# Altium project PCB_Project_Soldeerstation.PrjPcb
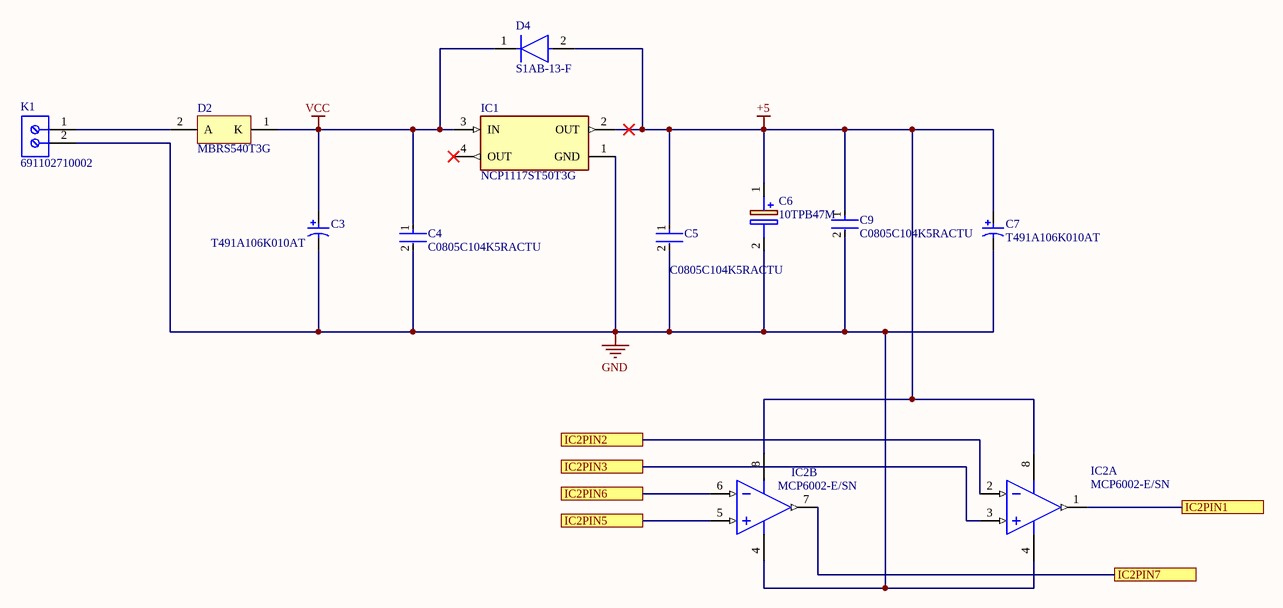
[diagram p0: Schema_Soldeerbout1.SchDoc]
6 sheets, 67 parts. Net scope: flat (ports and power ports of the same name join across sheets).
Board file: Soldeerstation_PCB.PcbDoc
Sheets:
  Schema_Soldeerbout1.SchDoc
  Schema_Soldeerbout2.SchDoc
  ATMEGA.SchDoc
  Schema_Soldeerbout3.SchDoc
  Schema_Soldeerbout4.SchDoc
  Schema_Soldeerbout5.SchDoc

## Sheet Schema_Soldeerbout1.SchDoc
size A4; SheetNumber: 1; SheetTotal: 6

### Parts
C3  T491A106K010AT  [KEMT-A-3216-18-2_M]
C4  C0805C104K5RACTU  [FP-C0805C-DN-MFG]
C5  C0805C104K5RACTU  [FP-C0805C-DN-MFG]
C6  10TPB47M  [CAPPM3528X210N]
C7  T491A106K010AT  [KEMT-A-3216-18-2_M]
C9  C0805C104K5RACTU  [FP-C0805C-DN-MFG]
D2  MBRS540T3G  [ONSC-SMC-2-403-03_V]
D4  S1AB-13-F  [FP-SMB-MFG]
IC1  NCP1117ST50T3G  [FP-318H-MFG]
IC2  MCP6002-E/SN  [SOIC-SN8_M]  (parts A,B of 2)
K1  691102710002  [691102710002]

### Ports
IC2PIN1, IC2PIN2, IC2PIN3, IC2PIN5, IC2PIN6, IC2PIN7

### Nets
+5: C5.1 C6.1(+) C7.1 C9.1 D4.2(A) IC1.2(OUT) IC2.8(VDD)
GND: C3.2 C4.2 C5.2 C6.2(-) C7.2 C9.2 IC1.1(GND) IC2.4(VSS) K1.2
VCC: C3.1 C4.1 D2.1(K) D4.1(C) IC1.3(IN)
NetC12_1: IC2.3(VINA+) ; port IC2PIN3
NetD2_2: D2.2(A) K1.1
NetIC2_1: IC2.1(VOUTA) ; port IC2PIN1
NetIC2_2: IC2.2(VINA-) ; port IC2PIN2
NetIC2_5: IC2.5(VINB+) ; port IC2PIN5
NetIC2_6: IC2.6(VINB-) IC2.7(VOUTB) ; port IC2PIN7, port IC2PIN6

Not connected (* = marked no-connect by the designer): IC1 4(OUT)*

### Library data of the parts
C3 C7 = CMP-2000-05172-1: Capacitor, Tantalum, 10 uF, +/- 10%, 10 V, -55 to 125 degC, 2-Pin SMD (1206), RoHS, Tape and Reel; Manufacturer Size Code: A; Manufacturer: Kemet; Type: Molded; Online Catalog: T491Series; Other Names: 399-3684-2; Voltage - Rated: 10V; Lifetime @ Temp.: 2000Hrs@85degC; Product Training Modules: CapacitorBasics-TypicalUsesforCapacitorsDeratingGuidelinesforSurfaceMountTantalumCapacitors; ESR (Equivalent Series Resistance): 3.8Ohm; Capacitance: 10µF; Catalog Drawings: T49x,T5xxSeries_A-side1T49x,T5xxSeries_A,B-side2T49x,T5xxSeries_A,SBottom; Family: TantalumCapacitors; Manufacturer URL: http://www.kemet.com/; Datasheet URL: http://www.farnell.com/datasheets/1824869.pdf; Package Reference: 1206; Packaging: Tape&Reel(TR); Series: T491; Operating Temperature: -55degC~125degC; Mounting Type: SurfaceMount; Height - Seated (Max): 0.071"(1.80mm); Package / Case: 1206(3216Metric); Package Description: 2-Pin Surface Mount Device, Body 3.2 x 1.6 mm; Features: GeneralPurpose; Tolerance: ±10%; Lead Spacing: -; Size / Dimension: 0.126"Lx0.063"W(3.20mmx1.60mm); Standard Package: 2,000; Datasheet Version: Apr-14; Category: Capacitors
C4 C5 C9 = CMP-2007-00279-2: CAP CER 0.1UF 50V X7R 0805; Manufacturer: KEMET; Value: 0.10 μF; Tolerance: 0.1; Temperature Coefficient: 30ppm/°C; Material: Ceramic; Manufacturer Part Number: C0805C104K5RACTU; Device Class L2: Capacitors; Temperature Range Low: -55°C; Voltage Rating: 50 V; Digikey Description: CAP CER 0.1UF 50V X7R 0805; Category: Cap; ComponentLink2Description: Datasheet; Octopart: https://octopart.com/c0805c104k5ractu-kemet-143926; RoHS: TRUE; ComponentLink2URL: https://content.kemet.com/datasheets/KEM_C1003_C0G_SMD.pdf; Temperature Characteristic: X7R; Temperature: -55°C to +125°C; Height: 0.88mm; Temperature Range High: +125°C; Device Class L1: Passive Components; Automotive: No; Lead Free: Yes; Ipc Land Pattern Name: CAPC200125X78; Device Class L3: Ceramic Capacitors; Mouser Description: Cap Ceramic 0.1uF 50V X7R 10% SMD 2.0 x 1.2 mm 125 C Paper T/R; Capacitance: 0.10 μF; Package: C0805C-DN
C6 = 10TPB47M: Capacitor Polarised; Manufacturer_Name: Panasonic; Datasheet Link: https://www.mouser.com/datasheet/2/315/AAA8000C65-1150039.pdf; Height: 2.1mm; Manufacturer_Part_Number: 10TPB47M; Mouser Part Number: 667-10TPB47M; Mouser Price/Stock: https://www.mouser.co.uk/ProductDetail/Panasonic/10TPB47M/?qs=OE1iw1LrrPF6e38T0%252BNoyw%3D%3D; Arrow Part Number: 10TPB47M; Arrow Price/Stock: https://www.arrow.com/en/products/10tpb47m/panasonic
D2 = CMP-1055-00390-1: Schottky Power Rectifier, 2-Pin SMC, Pb-Free, Tape and Reel; Manufacturer: On Semiconductor; Configuration: Single; IFSM Max (A): 190; ComponentLink1URL: http://www.onsemi.com/; ComponentLink3URL: http://www.onsemi.com/pub_link/Collateral/403-03.PDF; ComponentLink1Description: Manufacturer URL; PackageVersion: Rev. E, 08/2005; Packing: Tape and Reel; ComponentLink2URL: http://www.onsemi.cn/pub_link/Collateral/MBRS540T3-D.PDF; RoHS: TRUE; DatasheetVersion: Rev. 8; Mounting Technology: Surface Mount; ComponentLink3Description: Package Specification; ComponentLink2Description: Datasheet; PartNumber: MBRS540T3G; PackageDescription: 2-Pin Small Molded Package, J-Bend Lead, Body 5.845 x 6.855 mm; PackageReference: SMC-2-403-03
D4 = CMP-0586-00001-3: DIODE GEN PURP 50V 1A SMB; Element Configuration: Single; Max Surge Current: 30A; Polarity: Standard; Recovery Time: 1.8us; Forward Voltage: 1.1V; Capacitance: 10pF; Peak Reverse Current: 5uA; Voltage Rating (DC): 50V; Weight: 0.00328oz; Average Rectified Current: 1A; Output Current: 1A; Number of Pins: 2; Lead Free: Lead Free; Packaging: Tape and Reel; Height: 2.42mm; Current Rating: 1A; Forward Current: 1A; Peak Non-Repetitive Surge Current: 30A; Reverse Voltage (DC): 50V; Max Reverse Voltage (DC): 50V; Reverse Recovery Time: 1.8us; Width: 3.94mm; Radiation Hardening: No; Case/Package: SMB; Min Operating Temperature: -65°C; Termination: SMD/SMT; Max Operating Temperature: 150°C; Package Quantity: 3000; Length: 4.57mm; Max Repetitive Reverse Voltage (Vrrm): 50V
IC1 = CMP-0592-00001-3: IC REG LINEAR 5V 1A SOT223; Output Type: Fixed; Quiescent Current: 10mA; Number of Outputs: 1; Polarity: Positive; Min Input Voltage: 3.5V; Input Bias Current: 6mA; Dropout Voltage: 1.2V; Power Rating: 781mW; Accuracy: 1%; Max Input Voltage: 20V; Max Output Current: 1A; Output Current: 1A; Packaging: Tape and Reel; Contact Plating: Tin; Package Quantity: 1; Halogen Free: Halogen Free; Case/Package: SOT-223; Radiation Hardening: No; Min Operating Temperature: 0°C; Min Current Limit: 1A; Max Operating Temperature: 125°C; Number of Regulators: 1; Number of Pins: 4; Width: 3.7mm; Lead Free: Lead Free; Output Voltage Accuracy: 1%; REACH SVHC: No SVHC; Length: 6.7mm; Output Voltage: 5V; Tolerance: 1%; Height: 1.69mm; Nominal Output Voltage: 5V
IC2 = CMP-0187-00368-2: 1 MHz, Low-Power Operational Amplifier, 8-Pin SOIC, Extended Temperature; ComponentLink1URL: http://www.microchip.com/; ComponentLink2URL: http://ww1.microchip.com/downloads/en/DeviceDoc/21733j.pdf; ComponentLink3URL: http://www.microchip.com/stellent/groups/techpub_sg/documents/packagingspec/en012702.pdf; Code_JEDEC: MS-012; PackageVersion: revBB, Aug-2009; ComponentLink2Description: Datasheet; PackageDescription: 8-Lead Plastic Small Outline (SN) - Narrow, 3.90mm Body [SOIC]; PackageReference: SOIC-SN8; ComponentLink1Description: Manufacturer URL; RevisionNote: URLs added.; Code_IPC: SOIC127P600-8; ComponentLink3Description: Package Specification; DatasheetVersion: revJ, Nov-2009
K1 = CMP-1502-03258-1: Series 102 - 5.00 mm Horizontal Entry Modular with Pressure Clamp WR-TBL, 2 pin; Manufacturer: Wurth Elektronik; Pin Number: 2; Pitch: 5.00mm; Manufacturer URL: http://www.we-online.de; Mounting Technology: THT; Publisher: WurthElektronik; Packaging: Box; Package Reference: 691102710002; Datasheet URL: http://katalog.we-online.de/em/datasheet/6911027100xx.pdf; Operating Temperature: -40to105degC; Part Number: 691102710002

## Sheet Schema_Soldeerbout2.SchDoc
size A4; SheetNumber: 2; SheetTotal: 6
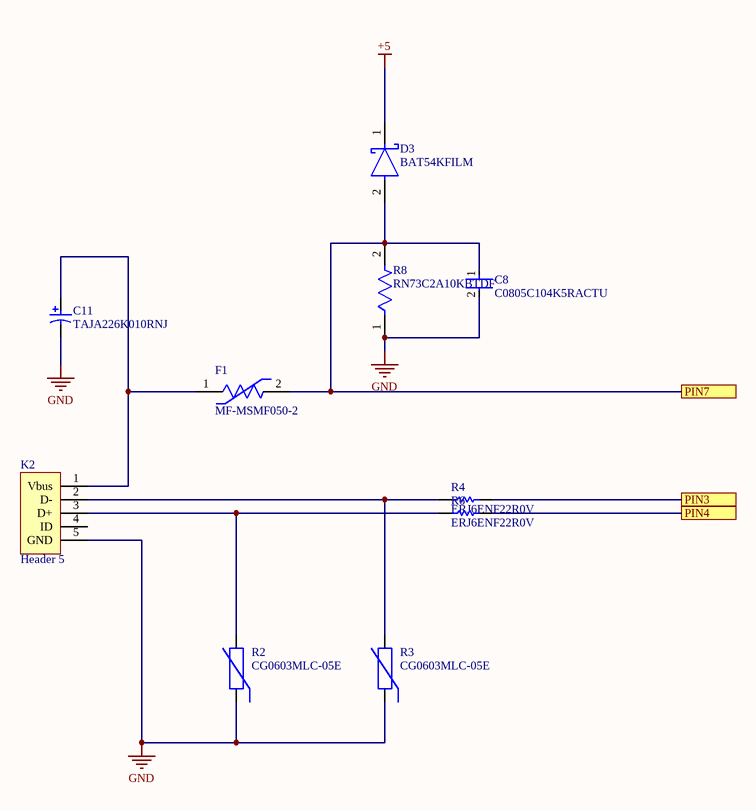
[diagram p1: Schema_Soldeerbout2.SchDoc]

### Parts
C8  C0805C104K5RACTU  [FP-C0805C-DN-MFG]
C11  TAJA226K010RNJ  [AVX-TAJ-A-2_L]
D3  BAT54KFILM  [FP-SOD-523-MFG]
F1  MF-MSMF050-2  [FP-MF-MSMF050-2-MFG]
K2  Header 5  [HDR1X5]
R2  CG0603MLC-05E  [BOUR-CG0603-2_V]
R3  CG0603MLC-05E  [BOUR-CG0603-2_V]
R4  ERJ6ENF22R0V  [RESC2013X70X40LL20T20]
R6  ERJ6ENF22R0V  [RESC2013X70X40LL20T20]
R8  RN73C2A10KBTDF  [FP-RN732A-MFG]

### Ports
PIN3, PIN4, PIN7

### Nets
+5: D3.1(C)
GND: C8.2 C11.2 K2.5(GND) R2.1 R3.1 R8.1
NetC8_1: C8.1 D3.2(A) F1.2 R8.2 ; port PIN7
NetC11_1: C11.1 F1.1 K2.1(Vbus)
NetIC4_3: R4.2 ; port PIN3
NetIC4_4: R6.2 ; port PIN4
NetK2_2: K2.2(D-) R3.2 R4.1
NetK2_3: K2.3(D+) R2.2 R6.1

Not connected (* = marked no-connect by the designer): K2 4(ID)

### Library data of the parts
C8 = CMP-2007-00279-2: as C4 on sheet Schema_Soldeerbout1; Manufacturer Part Number: C0805C104K5RACTU; Device Class L2: Capacitors; Temperature Range Low: -55°C; Voltage Rating: 50 V; Digikey Description: CAP CER 0.1UF 50V X7R 0805; Category: Cap; ComponentLink2Description: Datasheet; Octopart: https://octopart.com/c0805c104k5ractu-kemet-143926; RoHS: TRUE; ComponentLink2URL: https://content.kemet.com/datasheets/KEM_C1003_C0G_SMD.pdf; Temperature Characteristic: X7R; Temperature: -55°C to +125°C; Height: 0.88mm; Temperature Range High: +125°C; Device Class L1: Passive Components; Automotive: No; Lead Free: Yes; Ipc Land Pattern Name: CAPC200125X78; Device Class L3: Ceramic Capacitors; Mouser Description: Cap Ceramic 0.1uF 50V X7R 10% SMD 2.0 x 1.2 mm 125 C Paper T/R; Capacitance: 0.10 μF; Package: C0805C-DN
C11 = CMP-2000-07524-1: Chip Capacitor, 22 uF, +/- 10%, 10 V, -55 to 125 degC, 1206 (3216 Metric), RoHS, Tape and Reel; Manufacturer: AVX; Leakage Current: 2.2uA; Polarity: Polar; Dielectric Material: Tantalum; Voltage Rating (DC): 10V; Dissipation Factor: 8%; ESR (Equivalent Series Resistance): 3Ohm; Capacitance: 22uF; Height - Seated (Max): 0.071inch; Number of Pins: 2; Termination: SMD/SMT; Package Quantity: 1; Datasheet Version: 09/2017; Packaging: TapeandReel; Case/Package: 1206; Lead Free: LeadFree; Manufacturer URL: http://www.avx.com/; RoHSCompliant: True; Mount: PCB; Package Reference: TAJ-A-2; Width: 1.6mm; Height: 1.6mm; Radiation Hardening: No; Lead Pitch: 1.1mm; Tolerance: 10%; REACH SVHC: NoSVHC; Depth: 1.6mm; Package Description: 2-Pin Surface Mount Device, Body 3.2 x 1.65 mm; Case Code (Metric): 3216; Case Code (Imperial): 1206; Mounting Technology: SurfaceMount; Datasheet URL: http://datasheets.avx.com/TAJ.pdf; Voltage: 10V; Length: 3.2mm; Max Operating Temperature: 125degC; Voltage Rating: 10V; Min Operating Temperature: -55degC
D3 = CMP-12187-000026-1: DIODE SCHOTTKY 40V 300MA SOD523; Manufacturer: STMicroelectronics; Capacitance: 7pF; Value: 7pF; Max Surge Forward Current: 1.25A; Peak Reverse Current: 1uA; Max Junction Temp: +150°C; Device Class L2: Diodes; Temperature Range Low: -40°C; Category: Diode; Manufacturer Part Number: BAT54KFILM; Digikey Description: DIODE SCHOTTKY 40V 300MA SOD523; Device Class L3: Schottky Diodes; Automotive: No; Height: 0.7mm; Octopart: https://octopart.com/bat54kfilm-stmicroelectronics-39618022; ComponentLink2Description: Datasheet; Temperature Range High: +150°C; Device Class L1: Discrete Semiconductors; Max Repetitive Reverse Voltage: 40V; RoHS: TRUE; Temperature: -40°C to +150°C; ComponentLink2URL: https://www.st.com/content/ccc/resource/technical/document/datasheet/07/50/54/f2/0d/ba/4a/79/CD00001322.pdf/files/CD00001322.pdf/jcr:content/translations/en.CD00001322.pdf; Lead Free: Yes; Forward Current: 300mA; Package: SOD-523; Mouser Description: Schottky Diodes & Rectifiers schottky diode
F1 = CMP-2100-03653-2: PTC RESET FUSE 15V 500MA 1812; Manufacturer: Bourns; Value: 0.15-1Ω; Trip Current: 1A; Automotive Grade: Grade 3; Trip Time: 0.15s; Current Rating: 100A; Hold Current: 0.5A; Height: 0.85mm; Package: 1812; Voltage Rating: 15V; Temperature Range High: +85°C; Device Class L2: PTC Resettable Fuses; Lead Free: Yes; ComponentLink2URL: http://www.bourns.com/docs/Product-Datasheets/mfmsmf.pdf; Ambient Temperature Range High: +85°C; Mouser Description: PTC Resettable Fuse 0.5A(hold) 1A(trip) 15V 100A 0.8W 0.15s 0.15Ohm SMD Solder Pad 1812 T/R; Digikey Description: PTC RESET FUSE 15V 500MA 1812; Manufacturer Part Number: MF-MSMF050-2; Resistance: 0.15-1Ω; Category: Fuse; ComponentLink2Description: Datasheet; Automotive: Yes; Temperature Range Low: -40°C; RoHS: TRUE; Device Class L1: Circuit Protection; Temperature: -40°C to +85°C; Octopart: https://octopart.com/mf-msmf050-2-bourns-28047; Ambient Temperature Range Low: -40°C; Device Class L3: unset
K2 = Header 5: Header, 5-Pin; LatestRevisionDate: 17-Jul-2002; LatestRevisionNote: Re-released for DXP Platform.; Publisher: Altium Limited
R2 R3 = CMP-0584-00001-2: ESD Protector, 5 V Supply, -40 to 85 degC, 1.6 x 0.8 x 0.55 mm SMD, RoHS, Tape and Reel; Manufacturer: Bourns; VC: 20 V; VT: 150 V; RT: 1 ns; VDC: 5 V; CO: 0.5 pF; PartNumber: CG0603MLC-05E; ComponentLink1Description: Manufacturer URL; ComponentLink1URL: http://www.bourns.com/; Packing: Tape and Reel; Mounting Technology: Surface Mount; ComponentLink2Description: Datasheet; RoHS: TRUE; Operating Temperature: -40 to 85 degC; DatasheetVersion: Rev. S; PackageDescription: 2-Pin SMD, Body 1.6 x 0.8 mm, Pitch 1.52 mm; PackageReference: CG0603-2; ComponentLink2URL: http://www.bourns.com/data/global/pdfs/MLC.pdf
R4 R6 = CMP-2001-00523-1: Manufacturer: Panasonic; Part Number: ERJ6ENF22R0V
R8 = CMP-03211-000130-1: SMD Chip Resistor, Thin Film, 10KΩ, 100 V, 0805 [2012 Metric], 100 mW, 0.1%, RN73 Series; Manufacturer: TE Connectivity; Power Rating: 0.1W; Temperature Coefficient: 10ppm/°C; Voltage Rating: 100V; Package: RN732A; Ipc Land Pattern Name: RESC200125X55; RoHS: TRUE; packaging: 1000 Reel; Resistance: 10KΩ; Octopart: https://octopart.com/rn73c2a10kbtdf-te+connectivity-21400356; Temperature Range Low: -55°C; Device Class L1: Passive Components; Tolerance: 0.1%; ComponentLink2URL: https://www.te.com/commerce/DocumentDelivery/DDEController?Action=showdoc&DocId=Data+Sheet%7F1773270%7FP%7Fpdf%7FEnglish%7FENG_DS_1773270_P.pdf%7F1676162-2; Height: 0.65mm; Composition: Thin Film; Temperature Range High: 155°C; Automotive: No; Series: RN73; Lead Free: Yes; Value: 10KΩ; Category: Res; Device Class L2: Resistors; Temperature: -55°C to 155°C; octopart_url: https://octopart.com/rn73c2a10kbtdf-te+connectivity-21400356; Device Class L3: Chip SMD Resistors; ComponentLink2Description: Datasheet; Manufacturer Part Number: RN73C2A10KBTDF

## Sheet ATMEGA.SchDoc
size A4; SheetNumber: 3; SheetTotal: 6
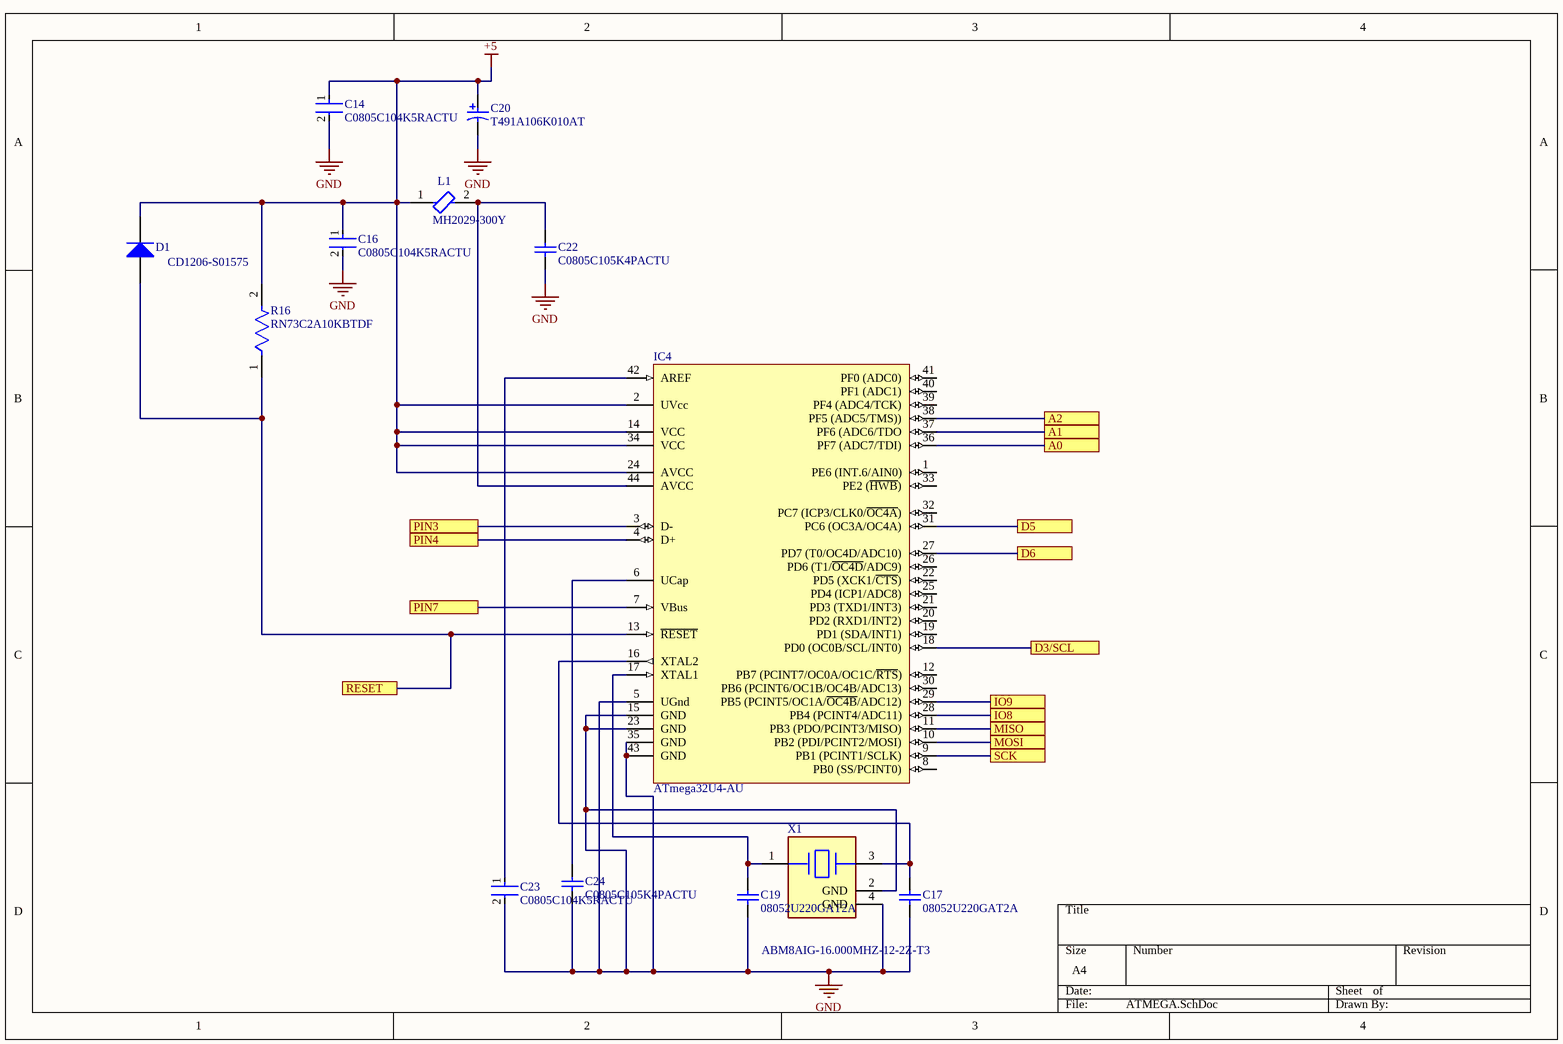
[diagram p2: ATMEGA.SchDoc]

### Parts
C14  C0805C104K5RACTU  [FP-C0805C-DN-MFG]
C16  C0805C104K5RACTU  [FP-C0805C-DN-MFG]
C17  08052U220GAT2A  [CAPC2013X115X51NL20T26]
C19  08052U220GAT2A  [CAPC2013X115X51NL20T26]
C20  T491A106K010AT  [KEMT-A-3216-18-2_M]
C22  C0805C105K4PACTU  [CAPC2013X145X50LL20T25]
C23  C0805C104K5RACTU  [FP-C0805C-DN-MFG]
C24  C0805C105K4PACTU  [CAPC2013X145X50LL20T25]
D1  CD1206-S01575  [BOUR-CD1206-S01575-2_L]
IC4  ATmega32U4-AU  [44ML_M]
L1  MH2029-300Y  [FP-MH2029-MFG]
R16  RN73C2A10KBTDF  [FP-RN732A-MFG]
X1  ABM8AIG-16.000MHZ-12-2Z-T3  [FP-ABM8AIG-MFG]

### Ports
A0, A1, A2, D3/SCL, D5, D6, IO8, IO9, MISO, MOSI, PIN3, PIN4, PIN7, RESET, SCK

### Nets
+5: C14.1 C16.1 C20.1 D1.2(K) IC4.2(UVcc) IC4.14(VCC) IC4.24(AVCC) IC4.34(VCC) L1.1 R16.2
GND: C14.2 C16.2 C17.1 C19.1 C20.2 C22.1 C23.2 C24.1 IC4.5(UGnd) IC4.15(GND) IC4.23(GND) IC4.35(GND) IC4.43(GND) X1.2(GND) X1.4(GND)
NetC1_2: IC4.27(PD7_(T0/OC4D/ADC10)) ; port D6
NetC2_2: IC4.29(PB5_(PCINT5/OC1A/~{OC4B}/ADC12)) ; port IO9
NetC8_1: IC4.7(VBus) ; port PIN7
NetC13_1: IC4.36(PF7_(ADC7/TDI)) ; port A0
NetC15_2: IC4.37(PF6_(ADC6/TDO) ; port A1
NetC17_2: C17.2 IC4.16(XTAL2) X1.3(2_Crystal)
NetC19_2: C19.2 IC4.17(XTAL1) X1.1(1_Crystal)
NetC22_2: C22.2 IC4.44(AVCC) L1.2
NetC23_1: C23.1 IC4.42(AREF)
NetC24_2: C24.2 IC4.6(UCap)
NetD1_1: D1.1(A) IC4.13(~{RESET}) R16.1 ; port RESET
NetENC1_1: IC4.28(PB4_(PCINT4/ADC11)) ; port IO8
NetIC4_3: IC4.3(D-) ; port PIN3
NetIC4_4: IC4.4(D+) ; port PIN4
NetIC4_9: IC4.9(PB1_(PCINT1/SCLK)) ; port SCK
NetIC4_10: IC4.10(PB2_(PDI/PCINT2/MOSI)) ; port MOSI
NetIC4_11: IC4.11(PB3_(PDO/PCINT3/MISO)) ; port MISO
NetIC4_18: IC4.18(PD0_(OC0B/SCL/INT0)) ; port D3/SCL
NetIC4_31: IC4.31(PC6_(OC3A/OC4A)) ; port D5
NetIC4_38: IC4.38(PF5_(ADC5/TMS))) ; port A2

Not connected (* = marked no-connect by the designer): IC4 1(PE6_(INT.6/AIN0)) 8(PB0_(SS/PCINT0)) 12(PB7_(PCINT7/OC0A/OC1C/~{RTS})) 19(PD1_(SDA/INT1)) 20(PD2_(RXD1/INT2)) 21(PD3_(TXD1/INT3)) 22(PD5_(XCK1/~{CTS})) 25(PD4_(ICP1/ADC8)) 26(PD6_(T1/~{OC4D}/ADC9)) 30(PB6_(PCINT6/OC1B/OC4B/ADC13)) 32(PC7_(ICP3/CLK0/~{OC4A})) 33(PE2_(~{HWB})) 39(PF4_(ADC4/TCK)) 40(PF1_(ADC1)) 41(PF0_(ADC0))

### Library data of the parts
C14 C16 C23 = CMP-2007-00279-2: as C4 on sheet Schema_Soldeerbout1; Manufacturer Part Number: C0805C104K5RACTU; Device Class L2: Capacitors; Temperature Range Low: -55°C; Voltage Rating: 50 V; Digikey Description: CAP CER 0.1UF 50V X7R 0805; Category: Cap; ComponentLink2Description: Datasheet; Octopart: https://octopart.com/c0805c104k5ractu-kemet-143926; RoHS: TRUE; ComponentLink2URL: https://content.kemet.com/datasheets/KEM_C1003_C0G_SMD.pdf; Temperature Characteristic: X7R; Temperature: -55°C to +125°C; Height: 0.88mm; Temperature Range High: +125°C; Device Class L1: Passive Components; Automotive: No; Lead Free: Yes; Ipc Land Pattern Name: CAPC200125X78; Device Class L3: Ceramic Capacitors; Mouser Description: Cap Ceramic 0.1uF 50V X7R 10% SMD 2.0 x 1.2 mm 125 C Paper T/R; Capacitance: 0.10 μF; Package: C0805C-DN
C17 C19 = CMP-2007-04866-1: Manufacturer: AVX Interconnect / Elco; Part Number: 08052U220GAT2A
C20 = CMP-2000-05172-1: as C3 on sheet Schema_Soldeerbout1; Family: TantalumCapacitors; Manufacturer URL: http://www.kemet.com/; Datasheet URL: http://www.farnell.com/datasheets/1824869.pdf; Package Reference: 1206; Packaging: Tape&Reel(TR); Series: T491; Operating Temperature: -55degC~125degC; Mounting Type: SurfaceMount; Height - Seated (Max): 0.071"(1.80mm); Package / Case: 1206(3216Metric); Package Description: 2-Pin Surface Mount Device, Body 3.2 x 1.6 mm; Features: GeneralPurpose; Tolerance: ±10%; Lead Spacing: -; Size / Dimension: 0.126"Lx0.063"W(3.20mmx1.60mm); Standard Package: 2,000; Datasheet Version: Apr-14; Category: Capacitors
C22 C24 = CMP-1036-04746-2: Manufacturer: Kemet; Part Number: C0805C105K4PACTU
D1 = CMP-0583-00001-2: 75 V Small Signal Switching Diode, 150 mA, 2.5 uA, 1026 Molded Package, RoHS, Tape and Reel; Manufacturer: Bourns; Reverse Voltage: 75 V; Average Forward Current: 150 mA; Reverse Current (Max.): 2.5 uA; Capacitance Between Terminals (Max.): 3 pF; Reverse Recovery Time (Max.): 4 nS; Forward Voltage (Max.): 1.00 V; Packing: Tape and Reel; Mounting Technology: Surface Mount; DatasheetVersion: Rev. 06/11; ComponentLink2URL: http://www.bourns.com/data/global/pdfs/CD1206_S01575.pdf; PackageReference: CD1206-S01575-2; RoHS: TRUE; ComponentLink1URL: http://www.bourns.com/; ComponentLink1Description: Manufacturer URL; ComponentLink3Description: Package Specification; ComponentLink3URL: http://www.bourns.com/data/global/pdfs/CD1206_S01575.pdf; ComponentLink2Description: Datasheet; PackageDescription: 2-Pin SMD, Body 3.2 x 1.5 mm; PartNumber: CD1206-S01575
IC4 = CMP-0095-00285-2: 8-bit AVR Microcontroller, 2.7-5.5V, 16MHz, 32KB Flash, 1KB EEPROM, 2.5KB SRAM, USB Controller, 44-pin TQFP, Industrial Grade (-40°C to 85°C), Ext Osc; RevisionNote: DatasheetVersion updated. URLs added.; ComponentLink1Description: Manufacturer URL; PackageDescription: 44-Pin Plastic Thin Quad Flat Pack, 10 x 10 x 1.0 mm Body, 0.8 mm Pitch (TQFP); DatasheetVersion: revF, Nov-2010; ComponentLink2URL: http://www.atmel.com/dyn/resources/prod_documents/doc7766.pdf; ComponentLink1URL: http://www.atmel.com/; PackageReference: 44ML; ComponentLink2Description: ATmega16U4/32U4 Datasheet; PackageVersion: rev.G, Jul-2007; ComponentLink3URL: http://www.atmel.com/dyn/resources/prod_documents/7766S.pdf; ComponentLink3Description: ATmega16U4 ATmega32U4 Summary
L1 = CMP-07252-000001-1: FERRITE BEAD 30 OHM 0805 1LN; Manufacturer: Bourns; Series Resistance: 25mΩ; Resistance: 30Ω; Value: 30Ω; Impedance At Frequency: 30Ω @ 100MHz; Rms Current: 3A; Tolerance: 25%; RoHS: TRUE; Manufacturer Part Number: MH2029-300Y; Temperature Range High: +125°C; Device Class L3: Ferrite Beads and Chips; Core Material: Ferrite; ComponentLink2Description: Datasheet; Category: FBead; Octopart: https://octopart.com/mh2029-300y-bourns-756929; Digikey Description: FERRITE BEAD 30 OHM 0805 1LN; Device Class L2: EMI / RFI Components; Lead Free: Yes; Mouser Description: Ferrite Beads 30 ohms 25% HIGH CURRENT; Automotive: No; Ipc Land Pattern Name: CAPC200120X90; Temperature: -55°C to +125°C; Device Class L1: Passive Components; Height: 1.1mm; ComponentLink2URL: https://www.bourns.com/docs/Product-Datasheets/mh.pdf; Package: MH2029; Temperature Range Low: -55°C
R16 = CMP-03211-000130-1: as R8 on sheet Schema_Soldeerbout2; Package: RN732A; Ipc Land Pattern Name: RESC200125X55; RoHS: TRUE; packaging: 1000 Reel; Resistance: 10KΩ; Octopart: https://octopart.com/rn73c2a10kbtdf-te+connectivity-21400356; Temperature Range Low: -55°C; Device Class L1: Passive Components; Tolerance: 0.1%; ComponentLink2URL: https://www.te.com/commerce/DocumentDelivery/DDEController?Action=showdoc&DocId=Data+Sheet%7F1773270%7FP%7Fpdf%7FEnglish%7FENG_DS_1773270_P.pdf%7F1676162-2; Height: 0.65mm; Composition: Thin Film; Temperature Range High: 155°C; Automotive: No; Series: RN73; Lead Free: Yes; Value: 10KΩ; Category: Res; Device Class L2: Resistors; Temperature: -55°C to 155°C; octopart_url: https://octopart.com/rn73c2a10kbtdf-te+connectivity-21400356; Device Class L3: Chip SMD Resistors; ComponentLink2Description: Datasheet; Manufacturer Part Number: RN73C2A10KBTDF
X1 = CMP-27762-000014-1: CRYSTAL 16MHZ 12PF SMD; Manufacturer: Abracon LLC; Automotive Grade: Grade 1; Stability: 50ppm; Tolerance: 20ppm; Esr: 70Ω; Load Capacitance: 12pF; Category: Crys; ComponentLink2Description: Datasheet; RoHS: TRUE; Temperature Range High: +125°C; Lead Free: Yes; Digikey Description: CRYSTAL 16MHZ 12PF SMD; Octopart: https://octopart.com/abm8aig-16.000mhz-12-2z-t3-abracon-70466545; Series: ABM8AIG; Manufacturer Part Number: ABM8AIG-16.000MHZ-12-2Z-T3; Automotive: Yes; Device Class L1: Passive Components; Mouser Description: Crystals 16MHz AECQ200 12pF 20ppm -40C +125C; Device Class L2: Crystals / Oscillators; ComponentLink2URL: https://abracon.com/AIGcrystals/ABM8AIG.pdf; Frequency: 16MHz; Package: ABM8AIG; Height: 0.8mm; Device Class L3: Crystals; Temperature Range Low: -40°C; Temperature: -40°C to +125°C

## Sheet Schema_Soldeerbout3.SchDoc
size A4; SheetNumber: 4; SheetTotal: 6
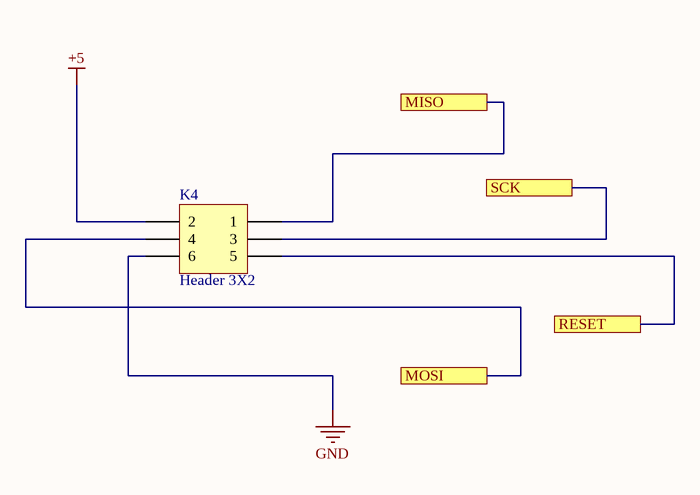
[diagram p3: Schema_Soldeerbout3.SchDoc]

### Parts
K4  Header 3X2  [HDR2X3]

### Ports
MISO, MOSI, RESET, SCK

### Nets
+5: K4.2
GND: K4.6
NetD1_1: K4.5 ; port RESET
NetIC4_9: K4.3 ; port SCK
NetIC4_10: K4.4 ; port MOSI
NetIC4_11: K4.1 ; port MISO

### Library data of the parts
K4 = Header 3X2: Header, 3-Pin, Dual row; LatestRevisionDate: 17-Jul-2002; LatestRevisionNote: Re-released for DXP Platform.; Publisher: Altium Limited

## Sheet Schema_Soldeerbout4.SchDoc
size A4; SheetNumber: 5; SheetTotal: 6
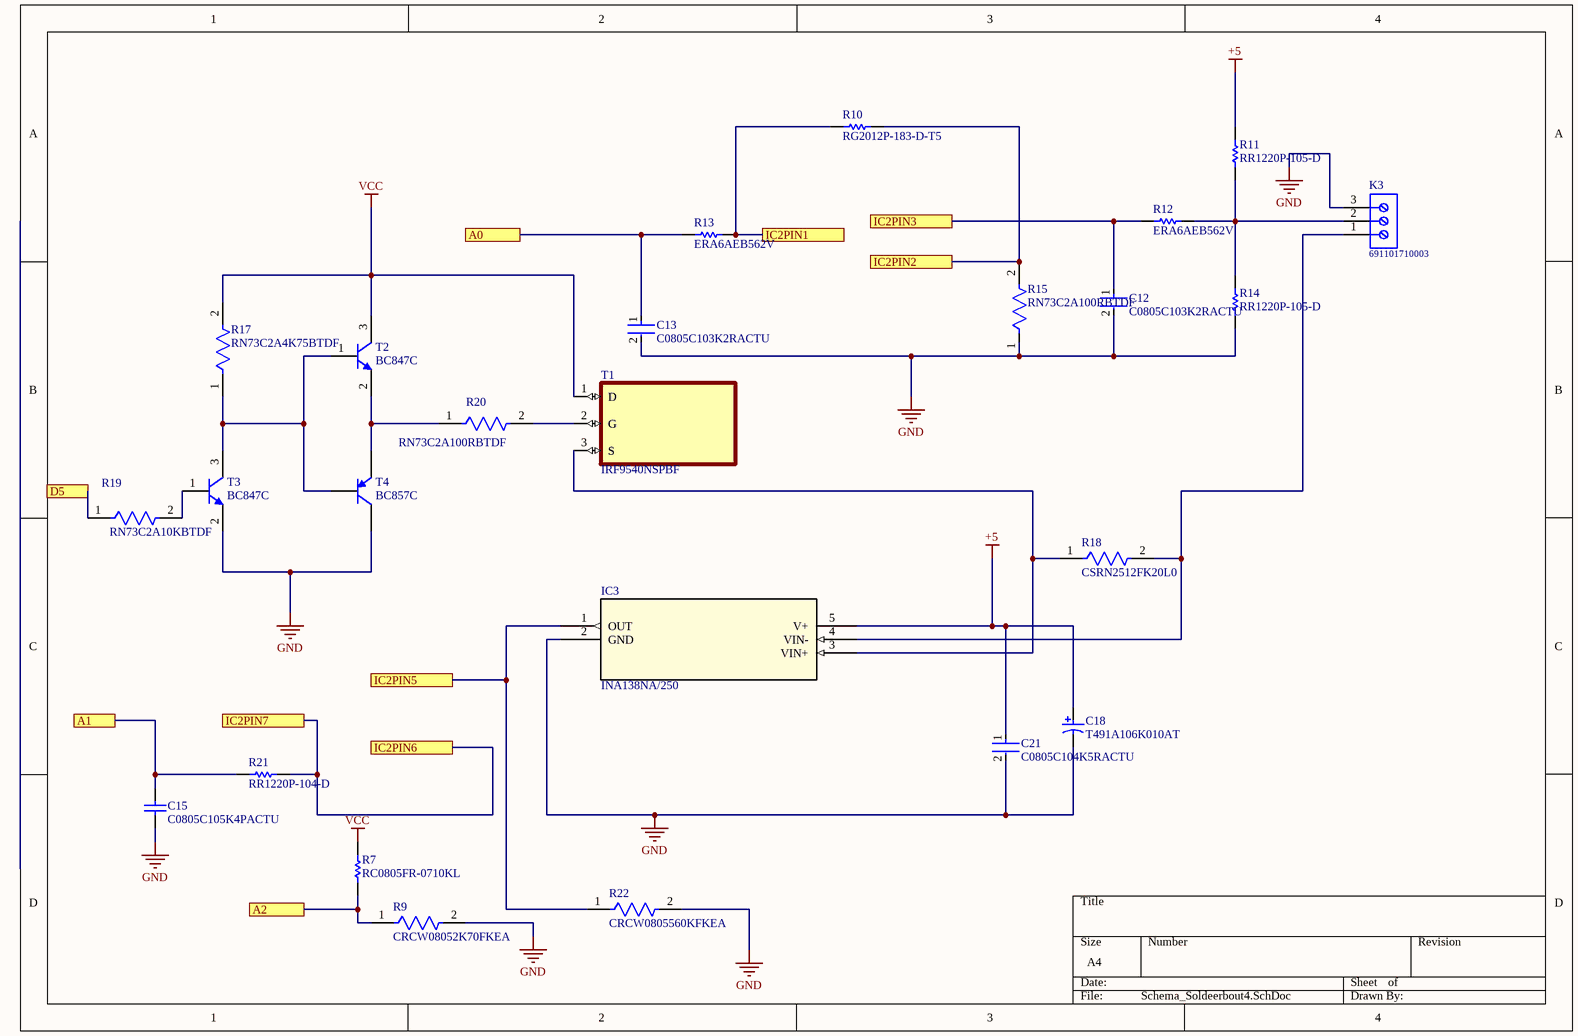
[diagram p4: Schema_Soldeerbout4.SchDoc]

### Parts
C12  C0805C103K2RACTU  [FP-C0805C-DN-MFG]
C13  C0805C103K2RACTU  [FP-C0805C-DN-MFG]
C15  C0805C105K4PACTU  [CAPC2013X145X50LL20T25]
C18  T491A106K010AT  [KEMT-A-3216-18-2_M]
C21  C0805C104K5RACTU  [FP-C0805C-DN-MFG]
IC3  INA138NA/250  [DBV5]
K3  691101710003  [691101710003]
R7  RC0805FR-0710KL  [RESC2013X60X35NL10T20]
R9  CRCW08052K70FKEA  [FP-CRCW0805-e3-IPC_C]
R10  RG2012P-183-D-T5  [RESC2013X50X40LL20T20]
R11  RR1220P-105-D  [RESC2013X50X40ML20T20]
R12  ERA6AEB562V  [RESC2013X60X40ML20T25]
R13  ERA6AEB562V  [RESC2013X60X40ML20T25]
R14  RR1220P-105-D  [RESC2013X50X40ML20T20]
R15  RN73C2A100RBTDF  [FP-RN732A-MFG]
R17  RN73C2A4K75BTDF  [FP-RN732A-MFG]
R18  CSRN2512FK20L0  [FP-CSRN2512-IPC_C]
R19  RN73C2A10KBTDF  [FP-RN732A-MFG]
R20  RN73C2A100RBTDF  [FP-RN732A-MFG]
R21  RR1220P-104-D  [RESC2013X50X40LL20T20]
R22  CRCW0805560KFKEA  [FP-CRCW0805-e3-IPC_A]
T1  IRF9540NSPBF  [DPAK508P1524X483-3N]
T2  BC847C  [INF-SOT23_L]
T3  BC847C  [INF-SOT23_L]
T4  BC857C  [INF-SOT23_N]

### Ports
A0, A1, A2, D5, IC2PIN1, IC2PIN2, IC2PIN3, IC2PIN5, IC2PIN6, IC2PIN7

### Nets
+5: C18.1 C21.1 IC3.5(V+) R11.2
GND: C12.2 C13.2 C15.1 C18.2 C21.2 IC3.2(GND) K3.3 R9.2 R14.1 R15.1 R22.2 T3.2(E) T4.3(C)
VCC: R7.2 R17.2 T1.1(D) T2.3(C)
NetC12_1: C12.1 R12.1 ; port IC2PIN3
NetC13_1: C13.1 R13.1 ; port A0
NetC15_2: C15.2 R21.1 ; port A1
NetIC2_1: R10.1 R13.2 ; port IC2PIN1
NetIC2_2: R10.2 R15.2 ; port IC2PIN2
NetIC2_5: IC3.1(OUT) R22.1 ; port IC2PIN5
NetIC2_6: R21.2 ; port IC2PIN6, port IC2PIN7
NetIC3_3: IC3.3(VIN+) R18.1 T1.3(S)
NetIC3_4: IC3.4(VIN-) K3.1 R18.2
NetIC4_31: R19.1 ; port D5
NetIC4_38: R7.1 R9.1 ; port A2
NetK3_2: K3.2 R11.1 R12.2 R14.2
NetR17_1: R17.1 T2.1(B) T3.3(C) T4.1(B)
NetR19_2: R19.2 T3.1(B)
NetR20_1: R20.1 T2.2(E) T4.2(E)
NetR20_2: R20.2 T1.2(G)

### Library data of the parts
C12 C13 = CMP-2007-00259-2: CAP CER 10000PF 200V X7R 0805; Manufacturer: KEMET; Material: Ceramic; Temperature Coefficient: 30ppm/°C; Capacitance: 10,000 pF; Tolerance: 0.1; Value: 10,000 pF; Device Class L2: Capacitors; Voltage Rating: 200 V; Temperature Range High: +125°C; ComponentLink2Description: Datasheet; Height: 0.88mm; Octopart: https://octopart.com/c0805c103k2ractu-kemet-9138347; ComponentLink2URL: https://content.kemet.com/datasheets/KEM_C1003_C0G_SMD.pdf; Category: Cap; Temperature: -55°C to +125°C; Temperature Range Low: -55°C; Digikey Description: CAP CER 10000PF 200V X7R 0805; Manufacturer Part Number: C0805C103K2RACTU; Temperature Characteristic: X7R; Automotive: No; Device Class L3: Ceramic Capacitors; Mouser Description: KEMET - C0805C103K2RACTU - CAP, MLCC, X7R, 10NF, 200V, 0805; RoHS: TRUE; Device Class L1: Passive Components; Lead Free: Yes; Package: C0805C-DN; Ipc Land Pattern Name: CAPC200125X78
C15 = CMP-1036-04746-2: Manufacturer: Kemet; Part Number: C0805C105K4PACTU
C18 = CMP-2000-05172-1: as C3 on sheet Schema_Soldeerbout1; Family: TantalumCapacitors; Manufacturer URL: http://www.kemet.com/; Datasheet URL: http://www.farnell.com/datasheets/1824869.pdf; Package Reference: 1206; Packaging: Tape&Reel(TR); Series: T491; Operating Temperature: -55degC~125degC; Mounting Type: SurfaceMount; Height - Seated (Max): 0.071"(1.80mm); Package / Case: 1206(3216Metric); Package Description: 2-Pin Surface Mount Device, Body 3.2 x 1.6 mm; Features: GeneralPurpose; Tolerance: ±10%; Lead Spacing: -; Size / Dimension: 0.126"Lx0.063"W(3.20mmx1.60mm); Standard Package: 2,000; Datasheet Version: Apr-14; Category: Capacitors
C21 = CMP-2007-00279-2: as C4 on sheet Schema_Soldeerbout1; Manufacturer Part Number: C0805C104K5RACTU; Device Class L2: Capacitors; Temperature Range Low: -55°C; Voltage Rating: 50 V; Digikey Description: CAP CER 0.1UF 50V X7R 0805; Category: Cap; ComponentLink2Description: Datasheet; Octopart: https://octopart.com/c0805c104k5ractu-kemet-143926; RoHS: TRUE; ComponentLink2URL: https://content.kemet.com/datasheets/KEM_C1003_C0G_SMD.pdf; Temperature Characteristic: X7R; Temperature: -55°C to +125°C; Height: 0.88mm; Temperature Range High: +125°C; Device Class L1: Passive Components; Automotive: No; Lead Free: Yes; Ipc Land Pattern Name: CAPC200125X78; Device Class L3: Ceramic Capacitors; Mouser Description: Cap Ceramic 0.1uF 50V X7R 10% SMD 2.0 x 1.2 mm 125 C Paper T/R; Capacitance: 0.10 μF; Package: C0805C-DN
IC3 = INA138NA/250: High-Side Measurement Current Shunt Monitor, Current Output; Manufacturer: Texas Instruments; GENERIC_PART_NUMBER: INA138; INDUSTRY_STD_PKG_TYPE: SOT-23; PIN_COUNT: 5; PACKAGE_DESIGNATOR: DBV; Datasheet_URL: http://www.ti.com/lit/gpn/INA138; FAMILY_NAME: CURRENT SHUNT MONITOR; Vendor: Texas Instruments; Manufacturer_Part_Number: INA138NA/250; Copyright: Copyright (C) 2018 Accelerated Designs. All rights reserved; RefDes: RefDes; Type: DEV
K3 = CMP-1502-03257-1: Series 101 - 5.00 mm Horizontal Entry Modular with Pressure Clamp WR-TBL, 3 pin; Manufacturer: Wurth Elektronik; Pitch: 5.00mm; Pin Number: 3; Publisher: WurthElektronik; Part Number: 691101710003; Operating Temperature: -40to105degC; Package Reference: 691101710003; Packaging: Box; Manufacturer URL: http://www.we-online.de; Datasheet URL: http://katalog.we-online.de/em/datasheet/6911017100xx.pdf; Mounting Technology: THT
R7 = CMP-1659-00013-4: Chip Resistor, 10 KOhm, +/- 1%, 0.125 W, -55 to 155 degC, 0805 (2012 Metric), RoHS, Tape and Reel; Manufacturer: Yageo; Voltage Rating: 150 V; Mount: Surface Mount; ComponentLink1Description: Manufacturer URL; ComponentLink2URL: http://www.yageo.com/documents/recent/PYu-RC_Group_51_RoHS_L_04.pdf; Pins: 2; Length: 2 mm; Min Operating Temperature: -55 degC; Height: 0.5 mm; Mounting Technology: Surface Mount; RoHSCompliant: true; REACH SVHC: No SVHC; ComponentLink1URL: http://www.yageo.com/; Max Operating Temperature: 155 degC; PackageReference: 0805; DatasheetVersion: Rev. 4, 02/2016; Package Quantity: 5000; Packaging: Tape and Reel; ComponentLink2Description: Datasheet; PackageDescription: 2-Pin Surface Mounted Device, Body 2 x 1.25 mm
R9 = CMP-1013-00557-4: RES Thick Film, 2.7kΩ, 1%, 0.125W, 100ppm/°C, 0805; Voltage Rating (DC): 150V; Power Rating: 125mW; Resistance: 2.7kR; Composition: Thick Film; Mount: Surface Mount; Case Code (Imperial): 0805; Features: Automotive AEC-Q200; Depth: 1.25mm; Height: 0.45mm; Weight: 0.000194oz; Min Operating Temperature: -55°C; Case Code (Metric): 2012; Number of Pins: 2; Packaging: Tape and Reel; Width: 1.25mm; Military Standard: Not; Max Power Dissipation: 125mW; Tolerance: 1%; Case/Package: 0805; Lead Free: Lead Free; Max Operating Temperature: 155°C; Number of Terminations: 2; Voltage Rating: 150V; Contact Plating: Tin; Length: 2mm; Termination: SMD/SMT; Package Quantity: 10; Temperature Coefficient: 100ppm/°C; Radiation Hardening: No
R10 = CMP-2001-02814-1: Manufacturer: Susumu; Part Number: RG2012P-183-D-T5
R11 R14 = CMP-2001-03219-1: Manufacturer: Susumu; Part Number: RR1220P-105-D
R12 R13 = CMP-2001-00653-1: Manufacturer: Panasonic; Part Number: ERA6AEB562V
R15 R20 = CMP-03211-000756-1: SMD Chip Resistor, Thin Film, 100Ω, 100 V, 0805 [2012 Metric], 100 mW, 0.1%, RN73 Series; Manufacturer: TE Connectivity; Voltage Rating: 100V; Temperature Coefficient: 10ppm/°C; Power Rating: 0.1W; Temperature Range Low: -55°C; Ipc Land Pattern Name: RESC200125X55; Series: RN73; ComponentLink2URL: https://www.te.com/commerce/DocumentDelivery/DDEController?Action=showdoc&DocId=Data+Sheet%7F1773270%7FP%7Fpdf%7FEnglish%7FENG_DS_1773270_P.pdf%7F1676162-2; Composition: Thin Film; Value: 100Ω; Device Class L1: Passive Components; Device Class L3: Chip SMD Resistors; Lead Free: Yes; Octopart: https://octopart.com/rn73c2a100rbtdf-te+connectivity-41188433; Temperature: -55°C to 155°C; packaging: 1000 Reel; Tolerance: 0.1%; Height: 0.65mm; Manufacturer Part Number: RN73C2A100RBTDF; Automotive: No; Temperature Range High: 155°C; Resistance: 100Ω; RoHS: TRUE; Category: Res; octopart_url: https://octopart.com/rn73c2a100rbtdf-te+connectivity-41188433; Package: RN732A; ComponentLink2Description: Datasheet; Device Class L2: Resistors
R17 = CMP-03211-008984-1: SMD Chip Resistor, Thin Film, 4.75KΩ, 100 V, 0805 [2012 Metric], 100 mW, 0.1%, RN73 Series; Manufacturer: TE Connectivity; Voltage Rating: 100V; Temperature Coefficient: 10ppm/°C; Power Rating: 0.1W; Lead Free: Yes; RoHS: TRUE; Height: 0.65mm; ComponentLink2Description: Datasheet; Device Class L3: Chip SMD Resistors; Device Class L1: Passive Components; Device Class L2: Resistors; Automotive: No; packaging: 1000 Reel; octopart_url: https://octopart.com/rn73c2a4k75btdf-te+connectivity-21411993; Manufacturer Part Number: RN73C2A4K75BTDF; Temperature: -55°C to 155°C; Tolerance: 0.1%; Ipc Land Pattern Name: RESC200125X55; Temperature Range High: 155°C; Value: 4.75KΩ; Composition: Thin Film; ComponentLink2URL: https://www.te.com/commerce/DocumentDelivery/DDEController?Action=showdoc&DocId=Data+Sheet%7F1773270%7FP%7Fpdf%7FEnglish%7FENG_DS_1773270_P.pdf%7F1676162-2; Temperature Range Low: -55°C; Series: RN73; Package: RN732A; Category: Res; Octopart: https://octopart.com/rn73c2a4k75btdf-te+connectivity-21411993; Resistance: 4.75KΩ
R18 = CMP-26527-002510-1: Res Thick Film 2512 20mΩ 1% 2W ±200ppm/°C Molded SMD Plastic T/R; Resistance: 20mR; Case/Package: 2512; Case Code (Metric): 6432; Length: 0.25inch; Temperature Coefficient: 200ppm/°C; Width: 0.124inch; Min Operating Temperature: -55°C; Packaging: Tape and Reel; Max Operating Temperature: 155°C; Height: 0.028inch; Number of Terminations: 2; Contact Plating: Tin; Max Power Dissipation: 2W; Case Code (Imperial): 2512; Resistor Type: Thick Film; Depth: 3.15mm; RoHS Compliant: Yes; Series: CSRN; Size Code: 2512; Military Standard: Not; Lead Free: Lead Free; Tolerance: 1%; Power Rating: 2W; Mount: Surface Mount; Radiation Hardening: No; Construction: Rectangular
R19 = CMP-03211-000130-1: as R8 on sheet Schema_Soldeerbout2; Package: RN732A; Ipc Land Pattern Name: RESC200125X55; RoHS: TRUE; packaging: 1000 Reel; Resistance: 10KΩ; Octopart: https://octopart.com/rn73c2a10kbtdf-te+connectivity-21400356; Temperature Range Low: -55°C; Device Class L1: Passive Components; Tolerance: 0.1%; ComponentLink2URL: https://www.te.com/commerce/DocumentDelivery/DDEController?Action=showdoc&DocId=Data+Sheet%7F1773270%7FP%7Fpdf%7FEnglish%7FENG_DS_1773270_P.pdf%7F1676162-2; Height: 0.65mm; Composition: Thin Film; Temperature Range High: 155°C; Automotive: No; Series: RN73; Lead Free: Yes; Value: 10KΩ; Category: Res; Device Class L2: Resistors; Temperature: -55°C to 155°C; octopart_url: https://octopart.com/rn73c2a10kbtdf-te+connectivity-21400356; Device Class L3: Chip SMD Resistors; ComponentLink2Description: Datasheet; Manufacturer Part Number: RN73C2A10KBTDF
R21 = CMP-2001-03217-1: Manufacturer: Susumu; Part Number: RR1220P-104-D
R22 = CMP-2001-04009-2: RES Thick Film, 560kΩ, 1%, 0.125W, 100ppm/°C, 0805; Max Power Dissipation: 125mW; Voltage Rating (DC): 150V; Resistance: 560kR; Temperature Coefficient: 100ppm/°C; Contact Plating: Tin; Case/Package: 0805; Power Rating: 125mW; Lead Free: Lead Free; Case Code (Metric): 2012; Case Code (Imperial): 0805; Termination: SMD/SMT; Width: 0.049inch; Features: Automotive AEC-Q200; Weight: 0.000194oz; Max Operating Temperature: 155°C; Number of Terminations: 2; Length: 2mm; Military Standard: Not; Package Quantity: 10; Tolerance: 1%; Radiation Hardening: No; Composition: Thick Film; Height: 0.45mm; Min Operating Temperature: -55°C; Packaging: Tape and Reel; Voltage Rating: 150V; Depth: 1.25mm
T1 = IRF9540NSPBF: RoHS Compliant | Low RDS(on) | Industry-leading quality | Dynamic dv/dt Rating | Fast Switching | Fully Avalanche Rated | 175C Operating Temperature | P-Channel MOSFET; MF: Infineon; Value: *; Price: None; Package: D2PAK Infineon; Check_prices: https://www.snapeda.com/parts/IRF9540NSPBF/Infineon%20Technologies/view-part/572451/?ref=eda; Availability: Unavailable; SnapEDA_Link: https://www.snapeda.com/parts/IRF9540NSPBF/Infineon%20Technologies/view-part/572451/?ref=snap; MP: IRF9540NSPBF
T2 T3 = CMP-1177-00037-1: NPN Silicon AF Transistor, 45 V VCEO, 100 mA IC, SOT23, Reel, Green; Manufacturer: Infineon; VCEO (max): 45Â V; VEBO (max): 6Â V; fT (typ): 250Â MHz; VCBO (max): 50Â V; ICM (max): 200Â mA; Green: TRUE; IC (max): 100Â mA; Ptot (max): 330Â mW; ICBO (max): 15Â nA; PartNumber: BC847C; ComponentLink3URL: http://www.infineon.com/dgdl/SOT23-Package_Overview.pdf?folderId=db3a30431936bc4b0119532290053c66&fileId=db3a30431936bc4b0119533468123c85; ComponentLink3Description: Package Specification; Mounting Technology: Surface Mount; PackageDescription: 3-Pin Small Outline Transistor Package, 1.3 x 2.9 mm Body, 0.95 mm Pitch; PackageReference: SOT23; ComponentLink2URL: http://www.infineon.com/dgdl/bc847series_bc848series_bc849series_bc850series.pdf?folderId=db3a304314dca389011541d30fa21656&fileId=db3a304314dca389011541d4630a1657; ComponentLink2Description: Datasheet; ComponentLink1Description: Manufacturer URL; Polarity: NPN; ComponentLink1URL: http://www.infineon.com/; IBM (max): 200Â mA; Packing: Reel; PackageVersion: Apr-08
T4 = CMP-1177-00039-1: PNP Silicon AF Transistor, 45 V VCEO, 100 mA IC, SOT23, Reel, Green; Manufacturer: Infineon; VCBO (max): 50Â V; fT (typ): 250Â MHz; ICBO (max): 15Â nA; IC (max): 100Â mA; Green: TRUE; IBM (max): 200Â mA; VEBO (max): 5Â V; VCEO (max): 45Â V; Ptot (max): 330Â mW; PackageDescription: 3-Pin Small Outline Transistor Package, 1.3 x 2.9 mm Body, 0.95 mm Pitch; ComponentLink2Description: Datasheet; PackageReference: SOT23; ComponentLink3Description: Package Specification; ComponentLink1URL: http://www.infineon.com/; ComponentLink1Description: Manufacturer URL; Mounting Technology: Surface Mount; PackageVersion: Apr-08; ComponentLink3URL: http://www.infineon.com/dgdl/SOT23-Package_Overview.pdf?folderId=db3a30431936bc4b0119532290053c66&fileId=db3a30431936bc4b0119533468123c85; ComponentLink2URL: http://www.infineon.com/dgdl/bc857series_bc858series_bc859series_bc860series.pdf?folderId=db3a304314dca389011541d30fa21656&fileId=db3a304314dca389011541da0e3a1661; Polarity: PNP; ICM (max): 200Â mA; PartNumber: BC857C; Packing: Reel

## Sheet Schema_Soldeerbout5.SchDoc
size A4; SheetNumber: 6; SheetTotal: 6
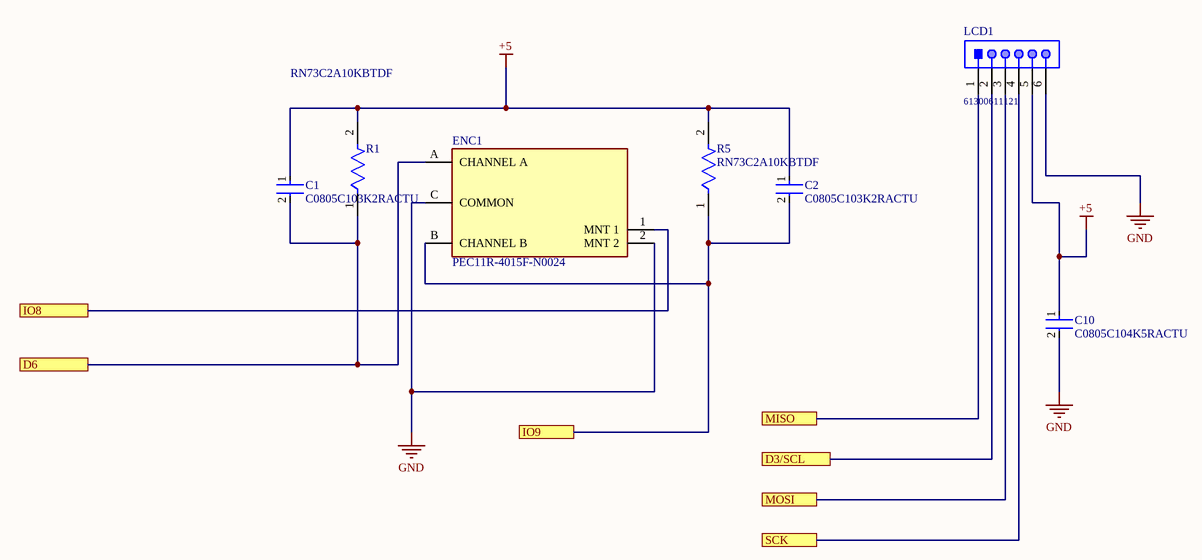
[diagram p5: Schema_Soldeerbout5.SchDoc]

### Parts
C1  C0805C103K2RACTU  [FP-C0805C-DN-MFG]
C2  C0805C103K2RACTU  [FP-C0805C-DN-MFG]
C10  C0805C104K5RACTU  [FP-C0805C-DN-MFG]
ENC1  PEC11R-4015F-N0024  [FP-PEC11R-4015F-N0024-MFG]
LCD1  61300611121  [61300611121]
R1  RN73C2A10KBTDF  [FP-RN732A-MFG]
R5  RN73C2A10KBTDF  [FP-RN732A-MFG]

### Ports
D3/SCL, D6, IO8, IO9, MISO, MOSI, SCK

### Nets
+5: C1.1 C2.1 C10.1 LCD1.5 R1.2 R5.2
GND: C10.2 ENC1.2(MNT_2) ENC1.C(COMMON) LCD1.6
NetC1_2: C1.2 ENC1.A(CHANNEL_A) R1.1 ; port D6
NetC2_2: C2.2 ENC1.B(CHANNEL_B) R5.1 ; port IO9
NetENC1_1: ENC1.1(MNT_1) ; port IO8
NetIC4_9: LCD1.4 ; port SCK
NetIC4_10: LCD1.3 ; port MOSI
NetIC4_11: LCD1.1 ; port MISO
NetIC4_18: LCD1.2 ; port D3/SCL

### Library data of the parts
C1 C2 = CMP-2007-00259-2: as C12 on sheet Schema_Soldeerbout4; Device Class L2: Capacitors; Voltage Rating: 200 V; Temperature Range High: +125°C; ComponentLink2Description: Datasheet; Height: 0.88mm; Octopart: https://octopart.com/c0805c103k2ractu-kemet-9138347; ComponentLink2URL: https://content.kemet.com/datasheets/KEM_C1003_C0G_SMD.pdf; Category: Cap; Temperature: -55°C to +125°C; Temperature Range Low: -55°C; Digikey Description: CAP CER 10000PF 200V X7R 0805; Manufacturer Part Number: C0805C103K2RACTU; Temperature Characteristic: X7R; Automotive: No; Device Class L3: Ceramic Capacitors; Mouser Description: KEMET - C0805C103K2RACTU - CAP, MLCC, X7R, 10NF, 200V, 0805; RoHS: TRUE; Device Class L1: Passive Components; Lead Free: Yes; Package: C0805C-DN; Ipc Land Pattern Name: CAPC200125X78
C10 = CMP-2007-00279-2: as C4 on sheet Schema_Soldeerbout1; Manufacturer Part Number: C0805C104K5RACTU; Device Class L2: Capacitors; Temperature Range Low: -55°C; Voltage Rating: 50 V; Digikey Description: CAP CER 0.1UF 50V X7R 0805; Category: Cap; ComponentLink2Description: Datasheet; Octopart: https://octopart.com/c0805c104k5ractu-kemet-143926; RoHS: TRUE; ComponentLink2URL: https://content.kemet.com/datasheets/KEM_C1003_C0G_SMD.pdf; Temperature Characteristic: X7R; Temperature: -55°C to +125°C; Height: 0.88mm; Temperature Range High: +125°C; Device Class L1: Passive Components; Automotive: No; Lead Free: Yes; Ipc Land Pattern Name: CAPC200125X78; Device Class L3: Ceramic Capacitors; Mouser Description: Cap Ceramic 0.1uF 50V X7R 10% SMD 2.0 x 1.2 mm 125 C Paper T/R; Capacitance: 0.10 μF; Package: C0805C-DN
ENC1 = CMP-07421-000003-1: ROTARY ENCODER MECHANICAL 24PPR; Manufacturer: Bourns; Current Rating: 10mA; Number Of Circuits: 1; Conn Orientation: Vertical; Encoder Type: Incremental; Detent: No; Pulses Per Rev: 24; Voltage Rating Dc: 5V; Manufacturer Part Number: PEC11R-4015F-N0024; Height: 22.3mm; ComponentLink2URL: https://www.bourns.com/docs/product-datasheets/pec11r.pdf?sfvrsn=bb617cbf_7; Mouser Description: Encoders 15mm SHAFT NO SWITCH; Package: 0; RoHS: TRUE; Temperature Range High: +70°C; Device Class L1: Electromechanical; Device Class L3: Encoders; Temperature Range Low: -30°C; Device Class L2: Switches; Temperature: -30°C to +70°C; Category: Enc; ComponentLink2Description: Datasheet; Lead Free: Yes; Automotive: No; Octopart: https://octopart.com/pec11r-4015f-n0024-bourns-26648251; Digikey Description: ROTARY ENCODER MECHANICAL 24PPR
LCD1 = CMP-1502-01070-1: THT Vertical Pin Header WR-PHD, Pitch 2.54 mm, Single Row, 6 pins; Manufacturer: Wurth Elektronik; Gender: Male; Pin Number: 6; Pitch: 2.54mm; Working Voltage: 250VAC; Rated Current: 3A; Withstanding Voltage: 500VAC; Contact Resistance: 20mOhm; Operating Temperature: -40to105degC; Packaging: Bag; Datasheet URL: https://katalog.we-online.de/em/datasheet/6130xx11121.pdf; Package Reference: 61300611121; Mounting Technology: THT; Publisher: WurthElektronik; Part Number: 61300611121; Manufacturer URL: http://www.we-online.de; Row Number: Single; Orientation: Vertical
R1 R5 = CMP-03211-000130-1: as R8 on sheet Schema_Soldeerbout2; Package: RN732A; Ipc Land Pattern Name: RESC200125X55; RoHS: TRUE; packaging: 1000 Reel; Resistance: 10KΩ; Octopart: https://octopart.com/rn73c2a10kbtdf-te+connectivity-21400356; Temperature Range Low: -55°C; Device Class L1: Passive Components; Tolerance: 0.1%; ComponentLink2URL: https://www.te.com/commerce/DocumentDelivery/DDEController?Action=showdoc&DocId=Data+Sheet%7F1773270%7FP%7Fpdf%7FEnglish%7FENG_DS_1773270_P.pdf%7F1676162-2; Height: 0.65mm; Composition: Thin Film; Temperature Range High: 155°C; Automotive: No; Series: RN73; Lead Free: Yes; Value: 10KΩ; Category: Res; Device Class L2: Resistors; Temperature: -55°C to 155°C; octopart_url: https://octopart.com/rn73c2a10kbtdf-te+connectivity-21400356; Device Class L3: Chip SMD Resistors; ComponentLink2Description: Datasheet; Manufacturer Part Number: RN73C2A10KBTDF

## Nets that join several sheets
+5: Schema_Soldeerbout1 (7 pins), Schema_Soldeerbout2 (D3.1), ATMEGA (10 pins), Schema_Soldeerbout3 (K4.2), Schema_Soldeerbout4 (C18.1 C21.1 IC3.5 R11.2), Schema_Soldeerbout5 (6 pins)
GND: Schema_Soldeerbout1 (9 pins), Schema_Soldeerbout2 (6 pins), ATMEGA (15 pins), Schema_Soldeerbout3 (K4.6), Schema_Soldeerbout4 (13 pins), Schema_Soldeerbout5 (C10.2 ENC1.2 ENC1.C LCD1.6)
VCC: Schema_Soldeerbout1 (5 pins), Schema_Soldeerbout4 (R7.2 R17.2 T1.1 T2.3)
NetC1_2: ATMEGA (IC4.27), Schema_Soldeerbout5 (C1.2 ENC1.A R1.1)
NetC2_2: ATMEGA (IC4.29), Schema_Soldeerbout5 (C2.2 ENC1.B R5.1)
NetC8_1: Schema_Soldeerbout2 (C8.1 D3.2 F1.2 R8.2), ATMEGA (IC4.7)
NetC12_1: Schema_Soldeerbout1 (IC2.3), Schema_Soldeerbout4 (C12.1 R12.1)
NetC13_1: ATMEGA (IC4.36), Schema_Soldeerbout4 (C13.1 R13.1)
NetC15_2: ATMEGA (IC4.37), Schema_Soldeerbout4 (C15.2 R21.1)
NetD1_1: ATMEGA (D1.1 IC4.13 R16.1), Schema_Soldeerbout3 (K4.5)
NetENC1_1: ATMEGA (IC4.28), Schema_Soldeerbout5 (ENC1.1)
NetIC2_1: Schema_Soldeerbout1 (IC2.1), Schema_Soldeerbout4 (R10.1 R13.2)
NetIC2_2: Schema_Soldeerbout1 (IC2.2), Schema_Soldeerbout4 (R10.2 R15.2)
NetIC2_5: Schema_Soldeerbout1 (IC2.5), Schema_Soldeerbout4 (IC3.1 R22.1)
NetIC2_6: Schema_Soldeerbout1 (IC2.6 IC2.7), Schema_Soldeerbout4 (R21.2)
NetIC4_3: Schema_Soldeerbout2 (R4.2), ATMEGA (IC4.3)
NetIC4_4: Schema_Soldeerbout2 (R6.2), ATMEGA (IC4.4)
NetIC4_9: ATMEGA (IC4.9), Schema_Soldeerbout3 (K4.3), Schema_Soldeerbout5 (LCD1.4)
NetIC4_10: ATMEGA (IC4.10), Schema_Soldeerbout3 (K4.4), Schema_Soldeerbout5 (LCD1.3)
NetIC4_11: ATMEGA (IC4.11), Schema_Soldeerbout3 (K4.1), Schema_Soldeerbout5 (LCD1.1)
NetIC4_18: ATMEGA (IC4.18), Schema_Soldeerbout5 (LCD1.2)
NetIC4_31: ATMEGA (IC4.31), Schema_Soldeerbout4 (R19.1)
NetIC4_38: ATMEGA (IC4.38), Schema_Soldeerbout4 (R7.1 R9.1)